# EAGLE design relaydriver (EAGLE 6.3)
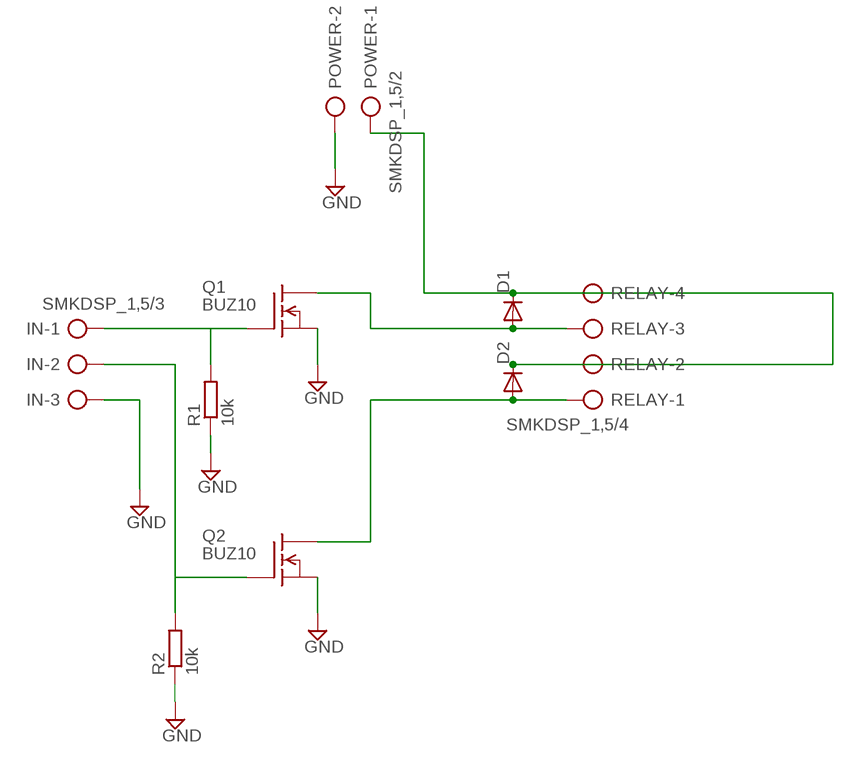
[diagram p0: schematic, sheet 1]

## Parts
D1  DIODE-DO201-15  [DO201-15]
D2  DIODE-DO201-15  [DO201-15]
IN  SMKDSP_1,5/3  [SMKDSP_1,5/3]
POWER  SMKDSP_1,5/2  [SMKDSP_1,5/2]
Q1  BUZ10  [TO220]
Q2  BUZ10  [TO220]
R1  10k  R-EU_0207/10  [0207/10]
R2  10k  R-EU_0207/10  [0207/10]
RELAY  SMKDSP_1,5/4  [SMKDSP_1,5/4]

## Nets
GND: IN.3 POWER.2 Q1.3(S) Q2.3(S) R1.1 R2.1
IN1: IN.1 Q1.1(G) R1.2
IN2: IN.2 Q2.1(G) R2.2
R1-SINK: D1.A Q1.2(D) RELAY.3
R2-SINK: D2.A Q2.2(D) RELAY.1
R-DRIVE: D1.C D2.C POWER.1 RELAY.2 RELAY.4

## Library data of the parts
D1 D2 = diode:DIODE-: DIODE
IN = con-phoenix-smkdsp:SMKDSP_1,5/3: Printklemme, Nennstrom: 17,5 A, Bemessungsspannung: 250 V, Raster: 5,0 mm Source: http://eshop.phoenixcontact.de .. 1733415.pdf; MF: FARNELL; MPN: 1733583; OC_FARNELL: 3041256; OC_NEWARK: 71C4130
POWER = con-phoenix-smkdsp:SMKDSP_1,5/2: Printklemme, Nennstrom: 17,5 A, Bemessungsspannung: 250 V, Raster: 5,0 mm Source: http://eshop.phoenixcontact.de .. 1733415.pdf; MF: FARNELL; MPN: 1733570; OC_FARNELL: 3041244; OC_NEWARK: 69C8588
Q1 Q2 = transistor-fet:BUZ10: N-Channel Enhancement MOSFET 50V; 20A; 0,080Ohm
R1 R2 = resistor:R-EU_: RESISTOR, European symbol
RELAY = con-phoenix-smkdsp:SMKDSP_1,5/4: Printklemme, Nennstrom: 17,5 A, Bemessungsspannung: 250 V, Raster: 5,0 mm Source: http://eshop.phoenixcontact.de .. 1733415.pdf; MF: FARNELL; MPN: 1733596; OC_FARNELL: 3041268; OC_NEWARK: 71C4131

## Board
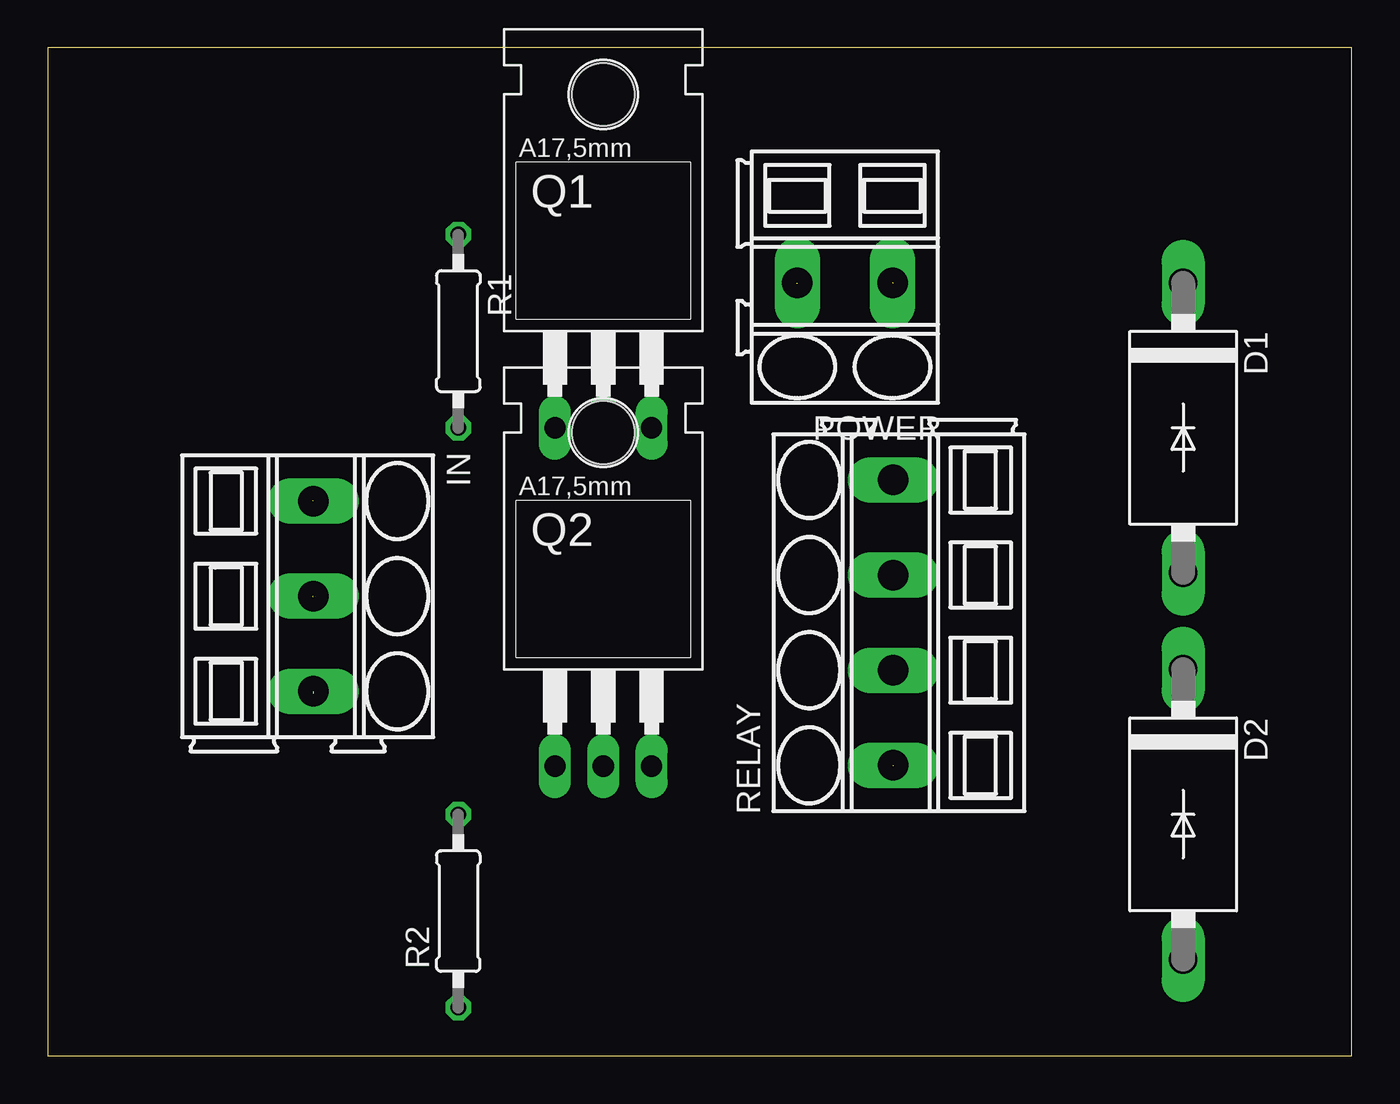
[diagram p1: board, top side]
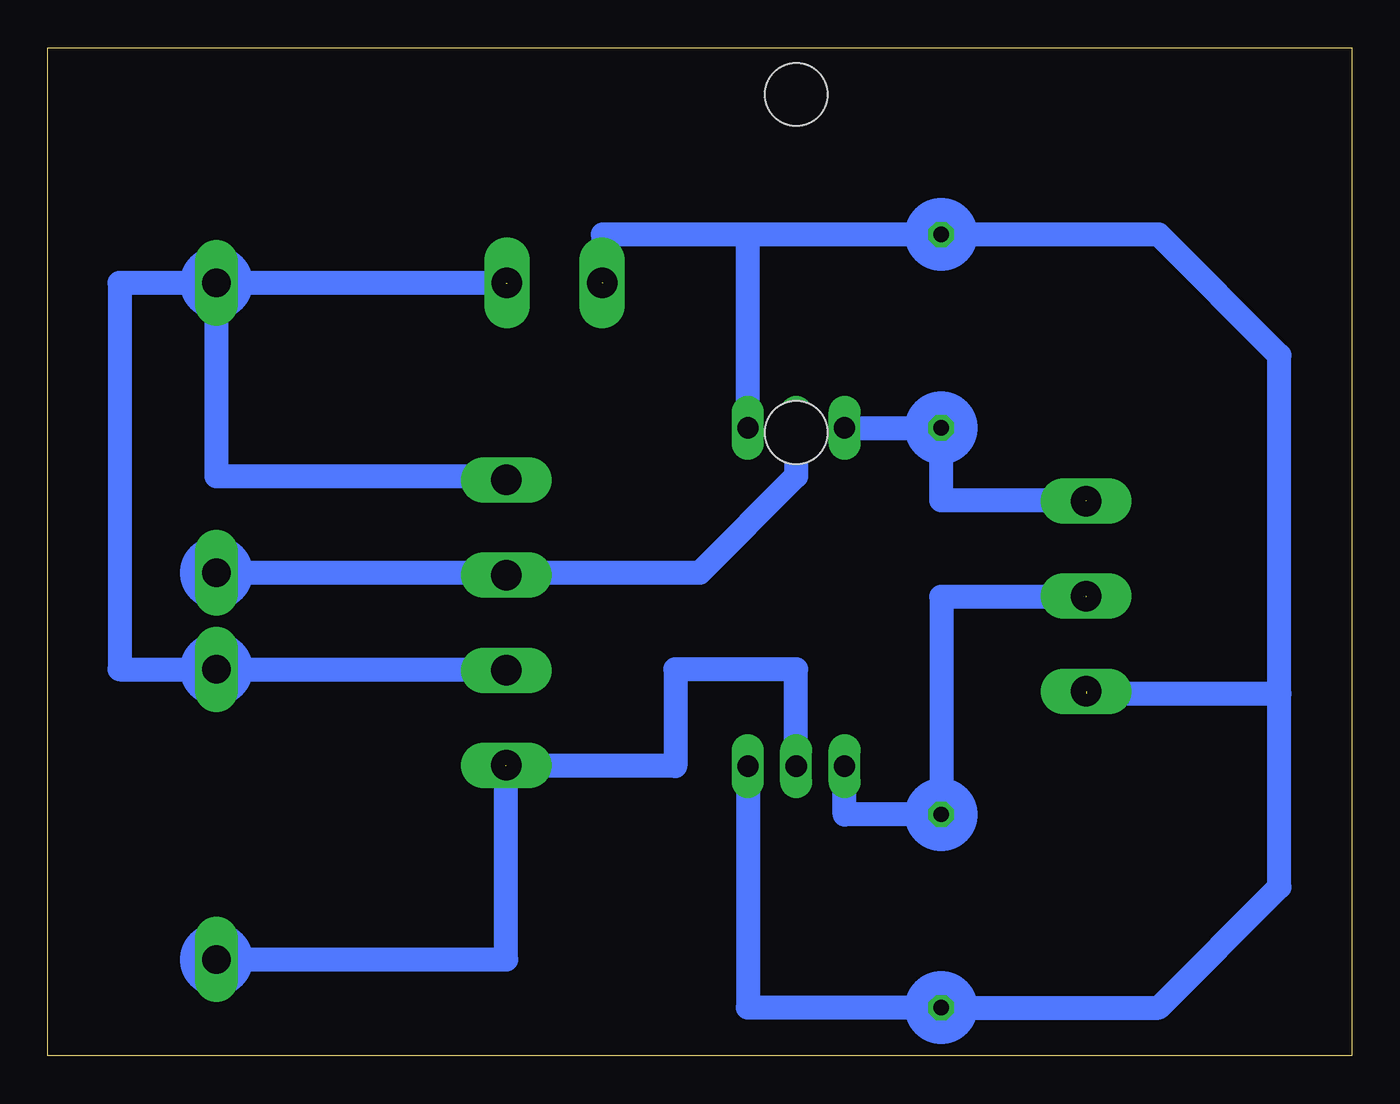
[diagram p2: board, bottom side, seen from below]

Size 68.56 x 53.01 mm. Coordinates in mm from the lower left corner, seen from the top.
Outline: 0,0 68.56,0 68.56,53.01 0,53.01 0,0
Copper layers (1*16): Top 0.035mm / dielectric 1.5mm / Bottom 0.035mm
Design rules "default": minimum track width 10mil, minimum drill 24mil, track to track 8mil, track to pad 8mil, pad to pad 8mil, via to via 8mil, smd to smd 8mil, copper to edge 40mil, drill to drill 8mil, minimum pad ring 10mil, minimum via ring 8mil, stop-mask expansion 4mil, vias tented up to drill 0mil, thermal gap 10mil

### Footprints (pad centres in the part's own frame; a part is rotated, then mirrored left to right if it is on the bottom)
DO201-15 = drill 1.499 long: A 7.62,0; C -7.62,0
SMKDSP_1,5/3 = drill 1.6 pad 1.8 long: 1 -2.5,0; 2 2.5,0; 3 7.5,0
SMKDSP_1,5/2 = drill 1.6 pad 1.8 long: 1 -2.5,0; 2 2.5,0
TO220 = drill 1.118 long: 1 -2.54,-6.35; 2 0,-6.35; 3 2.54,-6.35 | hole 3.302: 0,11.176
0207/10 = drill 0.813 octagon: 1 -5.08,0; 2 5.08,0
SMKDSP_1,5/4 = drill 1.6 pad 1.8 long: 1 -2.5,0; 2 2.5,0; 3 7.5,0; 4 12.5,0

### Placement (x,y rotation side)
D1  59.69,33.02 270 top
D2  59.69,12.7 270 top
IN  13.97,26.67 270 top
POWER  41.91,40.64 180 top
Q1  29.21,39.37 0 top
Q2  29.21,21.59 0 top
R1  21.59,38.1 270 top
R2  21.59,7.62 90 top
RELAY  44.45,17.78 90 top

### Tracks (layer width: path | path; a pad name or v marks a point on that pad's centre or on a via)
GND  (2 unrouted)
  Bottom 1.27: Q2.3 31.75,2.54 R2.1 10.16,2.54 3.81,8.89 3.81,19.05 | 31.75,43.18 R1.1 10.16,43.18 3.81,36.83 3.81,19.05 | 31.75,43.18 39.37,43.18 39.37,40.64 | Q1.3 31.75,43.18 | 13.97,19.05 3.81,19.05
IN1  (1 unrouted)
  Bottom 1.27: Q1.1 R1.2 21.59,29.21 13.97,29.21
IN2  (1 unrouted)
  Bottom 1.27: Q2.1 26.67,12.7 R2.2 21.59,24.13 13.97,24.13
R1-SINK
  Bottom 0.254: 44.45,25.4 RELAY.3
  Bottom 1.27: Q1.2 29.21,30.48 34.29,25.4 44.45,25.4 D1.A
R2-SINK  (1 unrouted)
  Bottom 1.27: Q2.2 29.21,20.32 35.56,20.32 35.56,15.24 44.45,15.24 44.45,5.08 D2.A
R-DRIVE  (1 unrouted)
  Bottom 0.254: 44.45,20.32 RELAY.2 | 44.45,30.48 RELAY.4
  Bottom 1.27: D1.C 59.69,30.48 44.45,30.48 | D1.C 64.77,40.64 64.77,20.32 D2.C 44.45,20.32 | 44.45,40.64 D1.C
(copper drawn outside any net)
  shapes: Bottom circle x8